# EAGLE design door_module_a (EAGLE 9.6.2)
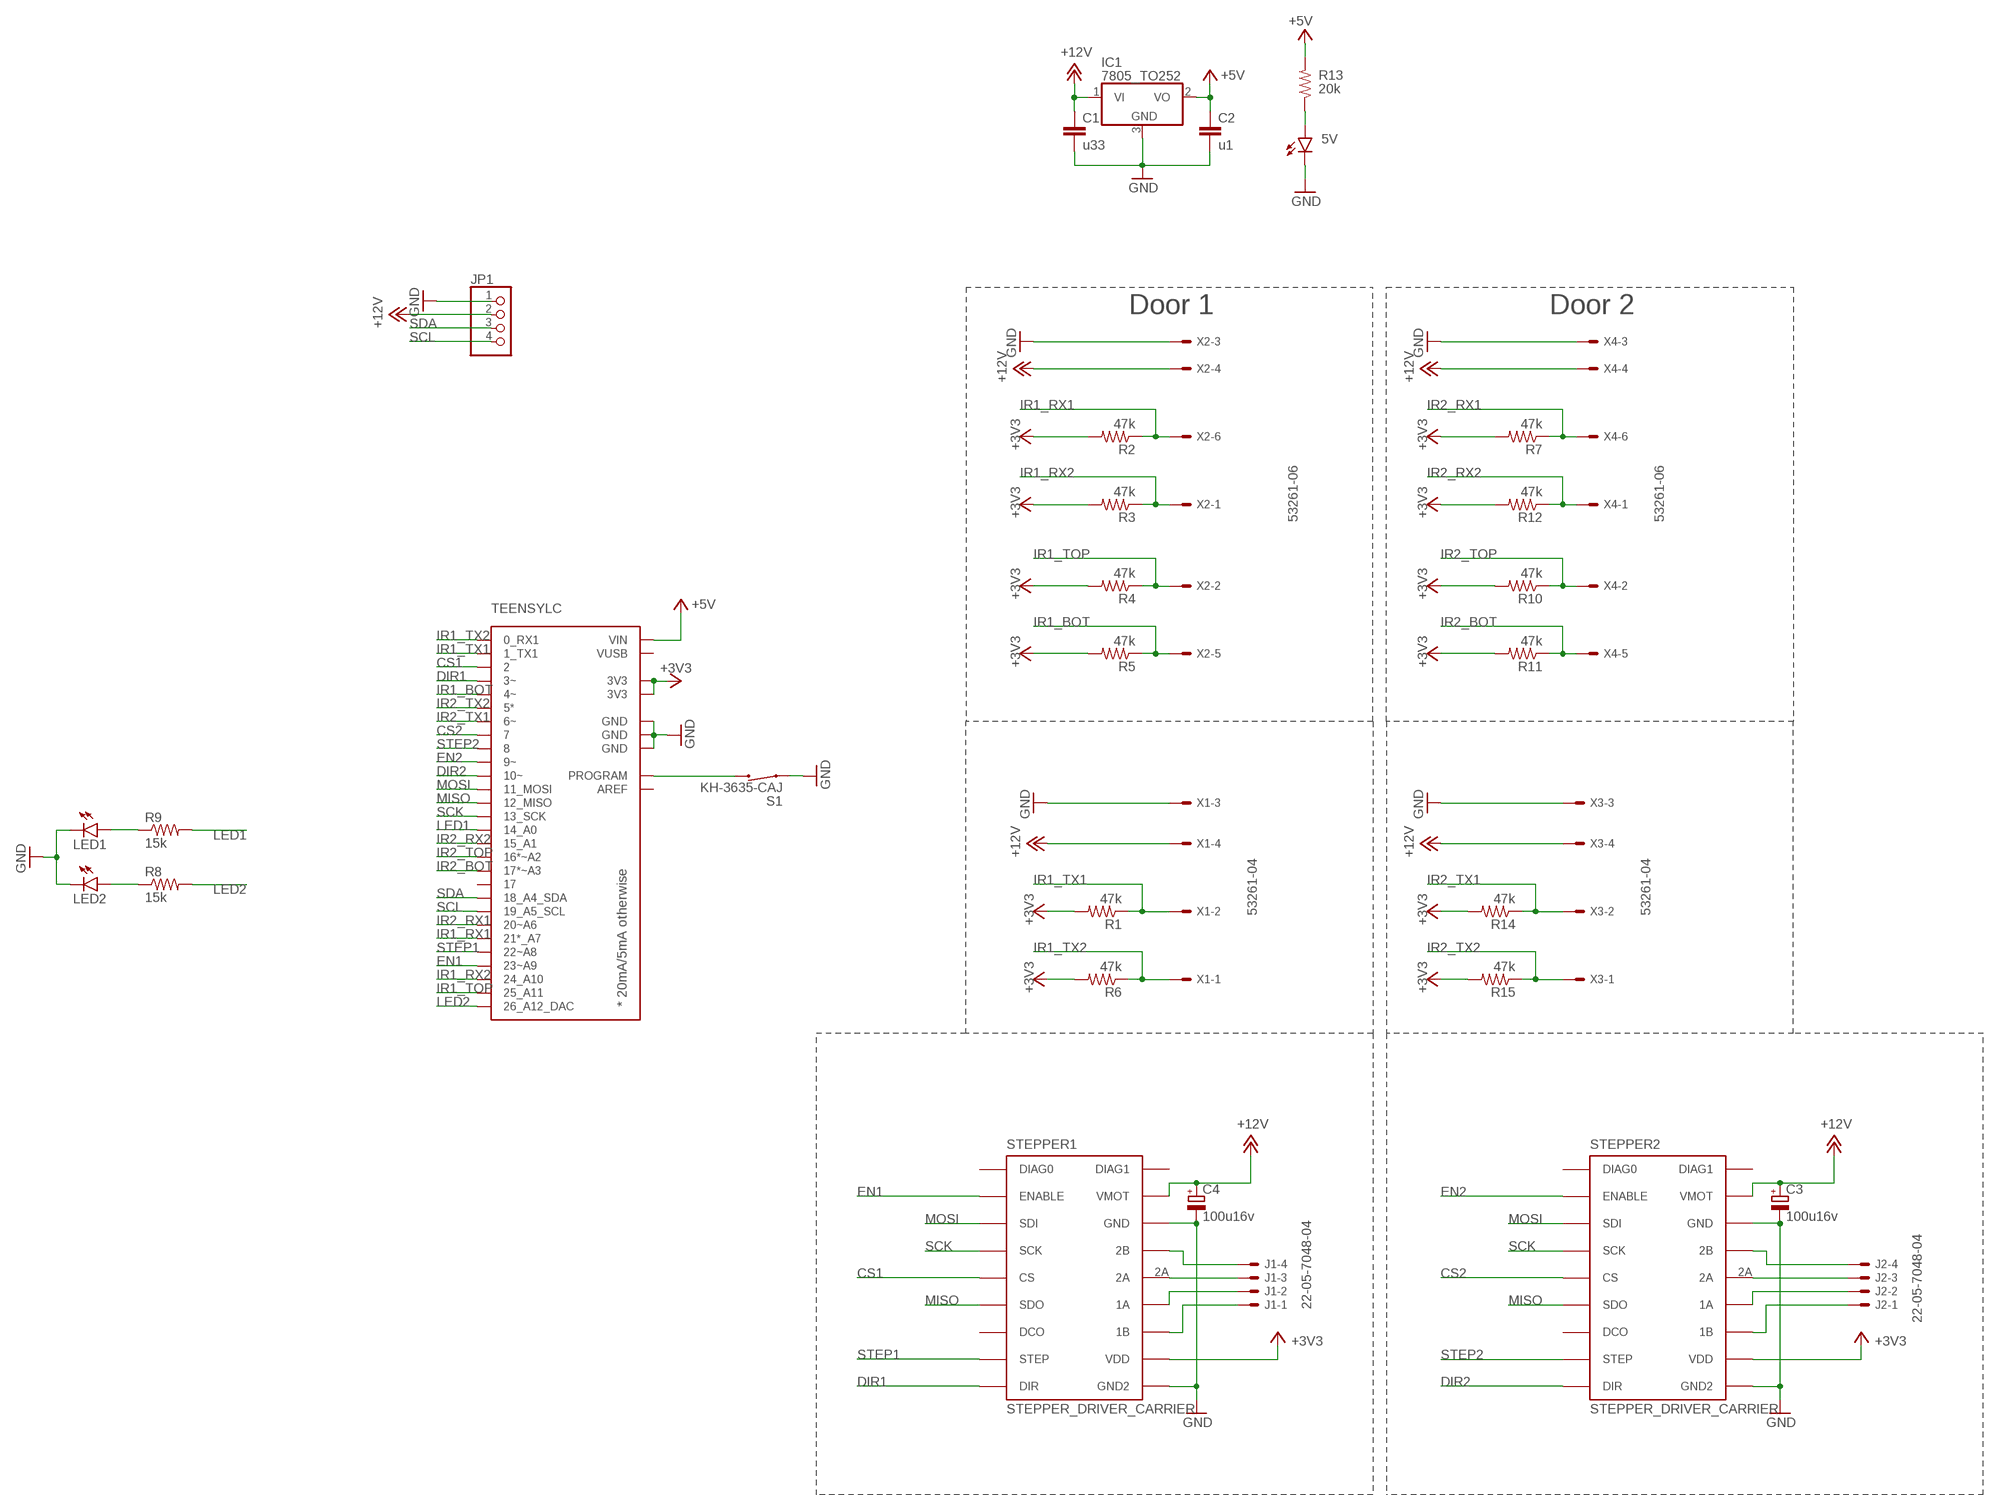
[diagram p0: schematic, sheet 1]

## Parts
5V  LEDCHIPLED_0805  [CHIPLED_0805]
C1  u33  C-EUC0805  [C0805]
C2  u1  C-EUC0805  [C0805]
C3  100u16v  CPOL-EUSMCC  [SMC_C]
C4  100u16v  CPOL-EUSMCC  [SMC_C]
IC1  7805_TO252  [TO252]
J1  22-05-7048-04  [7395-04]
J2  22-05-7048-04  [7395-04]
JP1  PINHD-1X4  [1X04]
LED1  LEDCHIPLED_0805  [CHIPLED_0805]
LED2  LEDCHIPLED_0805  [CHIPLED_0805]
R1  47k  R-US_R0805  [R0805]
R2  47k  R-US_R0805  [R0805]
R3  47k  R-US_R0805  [R0805]
R4  47k  R-US_R0805  [R0805]
R5  47k  R-US_R0805  [R0805]
R6  47k  R-US_R0805  [R0805]
R7  47k  R-US_R0805  [R0805]
R8  15k  R-US_R0805  [R0805]
R9  15k  R-US_R0805  [R0805]
R10  47k  R-US_R0805  [R0805]
R11  47k  R-US_R0805  [R0805]
R12  47k  R-US_R0805  [R0805]
R13  20k  R-US_R0805  [R0805]
R14  47k  R-US_R0805  [R0805]
R15  47k  R-US_R0805  [R0805]
S1  KH-3635-CAJ  [KH-3635-CAJ]
STEPPER1  STEPPER_DRIVER_CARRIER  [TMC2130_CARRIER]
STEPPER2  STEPPER_DRIVER_CARRIER  [TMC2130_CARRIER]
TEENSYLC  TEENSYLC  [TEENSYLC]
X1  53261-04  [53261-04]
X2  53261-06  [53261-06]
X3  53261-04  [53261-04]
X4  53261-06  [53261-06]

## Nets
+3V3: R1.2 R2.2 R3.2 R4.2 R5.2 R6.2 R7.2 R10.2 R11.2 R12.2 R14.2 R15.2 STEPPER1.VIO(VDD) STEPPER2.VIO(VDD) TEENSYLC.3V3 TEENSYLC.3V3@2(3V3)
+5V: C2.1 IC1.2(VO) R13.2 TEENSYLC.VIN
+12V: C1.1 C3.+ C4.+ IC1.1(VI) JP1.2 STEPPER1.VMOT STEPPER2.VMOT X1.4 X2.4 X3.4 X4.4
CS1: STEPPER1.CS/CFG3(CS) TEENSYLC.2
CS2: STEPPER2.CS/CFG3(CS) TEENSYLC.7
DIR1: STEPPER1.DIR TEENSYLC.3(3~)
DIR2: STEPPER2.DIR TEENSYLC.10(10~)
EN1: STEPPER1.ENABLE TEENSYLC.23(23~A9)
EN2: STEPPER2.ENABLE TEENSYLC.9(9~)
GND: 5V.C C1.2 C2.2 C3.- C4.- IC1.3(GND) JP1.1 LED1.C LED2.C S1.P$1 STEPPER1.GND STEPPER1.GND2 STEPPER2.GND STEPPER2.GND2 TEENSYLC.GND TEENSYLC.GND@1(GND) TEENSYLC.GND@2(GND) X1.3 X2.3 X3.3 X4.3
IR1_BOT: R5.1 TEENSYLC.4(4~) X2.5
IR1_RX1: R2.1 TEENSYLC.21(21*_A7) X2.6
IR1_RX2: R3.1 TEENSYLC.24(24_A10) X2.1
IR1_TOP: R4.1 TEENSYLC.25(25_A11) X2.2
IR1_TX1: R1.1 TEENSYLC.1(1_TX1) X1.2
IR1_TX2: R6.1 TEENSYLC.0(0_RX1) X1.1
IR2_BOT: R11.1 TEENSYLC.17(17*~A3) X4.5
IR2_RX1: R7.1 TEENSYLC.20(20~A6) X4.6
IR2_RX2: R12.1 TEENSYLC.15(15_A1) X4.1
IR2_TOP: R10.1 TEENSYLC.16(16*~A2) X4.2
IR2_TX1: R14.1 TEENSYLC.6(6~) X3.2
IR2_TX2: R15.1 TEENSYLC.5(5*) X3.1
LED1: R9.2 TEENSYLC.14(14_A0)
LED2: R8.2 TEENSYLC.26(26_A12_DAC)
MISO: STEPPER1.SDO/CFG0(SDO) STEPPER2.SDO/CFG0(SDO) TEENSYLC.12(12_MISO)
MOSI: STEPPER1.SDI/CFG1(SDI) STEPPER2.SDI/CFG1(SDI) TEENSYLC.11(11_MOSI)
N$1: LED2.A R8.1
N$2: LED1.A R9.1
N$3: S1.P$2 TEENSYLC.PROG(PROGRAM)
N$5: J1.4 STEPPER1.2B
N$6: J1.3 STEPPER1.2A
N$8: J1.2 STEPPER1.1A
N$10: J2.2 STEPPER2.1A
N$13: J1.1 STEPPER1.1B
N$14: J2.4 STEPPER2.2B
N$15: J2.3 STEPPER2.2A
N$25: 5V.A R13.1
N$28: J2.1 STEPPER2.1B
SCK: STEPPER1.SCK/CFG2(SCK) STEPPER2.SCK/CFG2(SCK) TEENSYLC.13(13_SCK)
SCL: JP1.4 TEENSYLC.19(19_A5_SCL)
SDA: JP1.3 TEENSYLC.18(18_A4_SDA)
STEP1: STEPPER1.STEP TEENSYLC.22(22~A8)
STEP2: STEPPER2.STEP TEENSYLC.8
Unconnected: STEPPER1.DCO STEPPER1.DIAG0 STEPPER1.DIAG1 STEPPER2.DCO STEPPER2.DIAG0 STEPPER2.DIAG1 TEENSYLC.17@VIN TEENSYLC.AREF TEENSYLC.VUSB

## Notes on the sheet
- Door 1 | Door 2

## Library data of the parts
5V LED1 LED2 = led:LED: LED OSRAM: - CHIPLED LG R971, LG N971, LY N971, LG Q971, LY Q971, LO R971, LY R971 LH N974, LH R974 LS Q976, LO Q976, LY Q976 LO Q996 - Hyper CHIPLED LW Q18S LB Q993, LB Q99A, LB R99A - SideLED LS A670, LO A670, LY A670, LG A670, LP A670 LB A673, LV A673, LT A673, LW A673 LH A674 LY A675 LS A676, LA A676, LO A676, LY A676, LW A676 LS A679, LY A679, LG A679 - Hyper Micro SIDELED® LS Y876, LA Y876, LO Y876, LY Y876 LT Y87S - SmartLED LW L88C, LW L88S LB L89C, LB L89S, LG L890 LS L89K, LO L89K, LY L89K LS L896, LA L896, LO L896, LY L896 - TOPLED LS T670, LO T670, LY T670, LG T670, LP T670 LSG T670, LSP T670, LSY T670, LOP T670, LYG T670 LG T671, LOG T671, LSG T671 LB T673, LV T673, LT T673, LW T673 LH T674 LS T676, LA T676, LO T676, LY T676, LB T676, LH T676, LSB T676, LW T676 LB T67C, LV T67C, LT T67C, LS T67K, LO T67K, LY T67K, LW E67C LS E67B, LA E67B, LO E67B, LY E67B, LB E67C, LV E67C, LT E67C LW T67C LS T679, LY T679, LG T679 LS T770, LO T770, LY T770, LG T770, LP T770 LB T773, LV T773, LT T773, LW T773 LH T774 LS E675, LA E675, LY E675, LS T675 LS T776, LA T776, LO T776, LY T776, LB T776 LHGB T686 LT T68C, LB T68C - Hyper Mini TOPLED® LB M676 - Mini TOPLED Santana® LG M470 LS M47K, LO M47K, LY M47K Source: http://www.osram.convergy.de LUXEON: - LUMILED® LXK2-PW12-R00, LXK2-PW12-S00, LXK2-PW14-U00, LXK2-PW14-V00 LXK2-PM12-R00, LXK2-PM12-S00, LXK2-PM14-U00 LXK2-PE12-Q00, LXK2-PE12-R00, LXK2-PE12-S00, LXK2-PE14-T00, LXK2-PE14-U00 LXK2-PB12-K00, LXK2-PB12-L00, LXK2-PB12-M00, LXK2-PB14-N00, LXK2-PB14-P00, LXK2-PB14-Q00 LXK2-PR12-L00, LXK2-PR12-M00, LXK2-PR14-Q00, LXK2-PR14-R00 LXK2-PD12-Q00, LXK2-PD12-R00, LXK2-PD12-S00 LXK2-PH12-R00, LXK2-PH12-S00 LXK2-PL12-P00, LXK2-PL12-Q00, LXK2-PL12-R00 Source: www.luxeon.com KINGBRIGHT: KA-3528ASYC Source: www.kingbright.com
C1 C2 = rcl:C-EU: CAPACITOR, European symbol; SPICEPREFIX: C
C3 C4 = rcl:CPOL-EU: POLARIZED CAPACITOR, European symbol; SPICEPREFIX: C
IC1 = 000-my_library:7805_TO252
J1 J2 = con-molex:22-?-04: CONNECTOR wire to board 2.54 mm (.1 inch) pitch header; MF: MOLEX; OC_FARNELL: unknown; OC_NEWARK: unknown
JP1 = pinhead:PINHD-1X4: PIN HEADER
R1-R15 = rcl:R-US_: RESISTOR, American symbol; SPICEPREFIX: R
S1 = 000-my_library:KH-3635-CAJ
STEPPER1 STEPPER2 = 000-my_library:STEPPER_DRIVER_CARRIER
TEENSYLC = 000-my_library:TEENSYLC
X1 X3 = con-molex:53?-04: CONNECTOR wire to board 1.25 mm (.049 inch) pitch header; MF: MOLEX; OC_FARNELL: 1125374; OC_NEWARK: unknown
X2 X4 = con-molex:53?-06: CONNECTOR wire to board 1.25 mm (.049 inch) pitch header; MF: MOLEX; OC_FARNELL: 1125375; OC_NEWARK: unknown

## Board
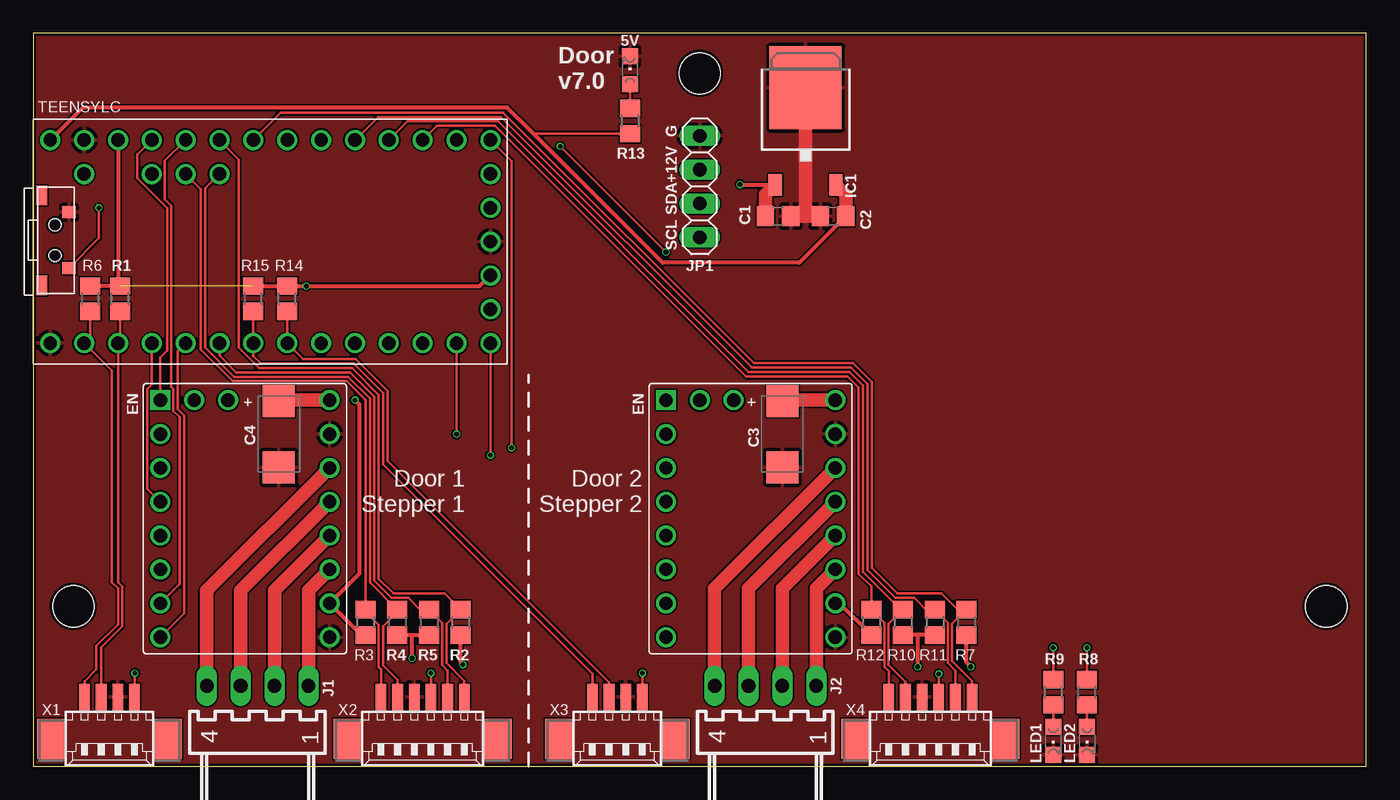
[diagram p1: board, top side]
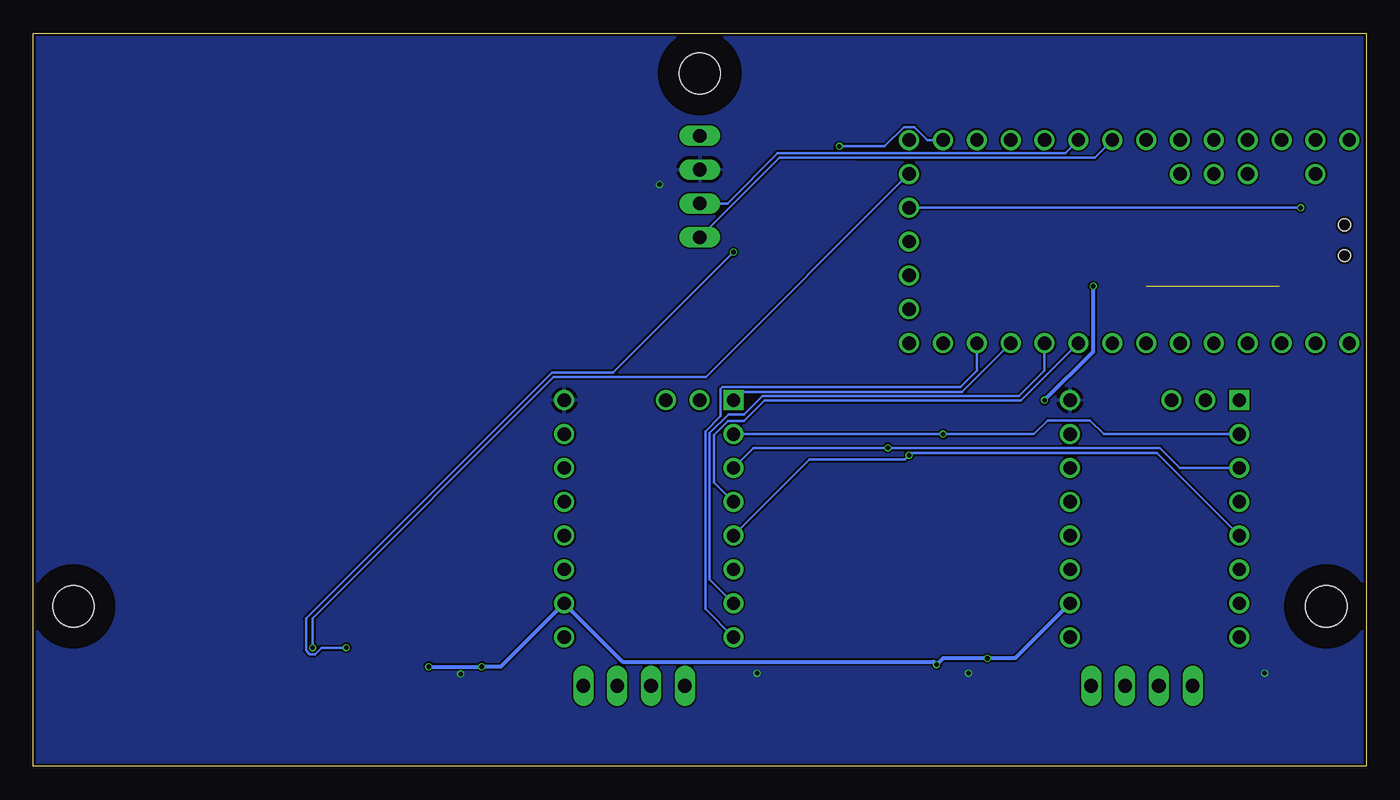
[diagram p2: board, bottom side, seen from below]

Size 100 x 55 mm. Coordinates in mm from the lower left corner, seen from the top.
Outline: 100,0 100,55 0,55 0,0 100,0
Copper layers (1*16): Top 0.035559375mm / dielectric 1.6mm / Bottom 0.035559375mm
Design rules "jlcpcb2layer *": minimum track width 8mil, minimum drill 12mil, track to track 5mil, track to pad 5mil, pad to pad 5mil, via to via 5mil, smd to smd 5mil, copper to edge 8mil, drill to drill 6mil, minimum pad ring 5mil, minimum via ring 3mil, stop-mask expansion 2.5mil, vias tented up to drill 0mil, thermal gap 10mil
Holes 3.1 mm at 97,12 50,52 3,12
bRestrict: area 46.9,48.9 to 53.1,55.1; area 93.9,8.9 to 100.1,15.1; area -0.1,8.9 to 6.1,15.1

### Footprints (pad centres in the part's own frame; a part is rotated, then mirrored left to right if it is on the bottom)
CHIPLED_0805 = smd 1.2 x 1.2: A 0,-1.05; C 0,1.05
C0805 = smd 1.3 x 1.5: 1 -0.95,0; 2 0.95,0
SMC_C = smd 2.4 x 2.4: + -2.5,0; - 2.5,0
TO252 = smd 1 x 1.6: 1 -2.28,-4.8; 2 2.28,-4.8 | smd 5.4 x 6.2: 3 0,2.5
7395-04 = drill 1.016 long: 1 3.81,0; 2 1.27,0; 3 -1.27,0; 4 -3.81,0
1X04 = drill 1.016 long: 1 -3.81,0; 2 -1.27,0; 3 1.27,0; 4 3.81,0
R0805 = smd 1.3 x 1.5: 1 -0.95,0; 2 0.95,0
KH-3635-CAJ = smd 0.9 x 1: P$1 -2.1,1.05; P$2 2.1,1.05 | smd 1.45 x 0.8: P$3 -3.375,-1; P$4 3.375,-1 | hole 0.9: -1.15,0; 1.15,0
TMC2130_CARRIER = drill 1: 1A 13.97,8.89; 1B 13.97,6.35; 2A 13.97,11.43; 2B 13.97,13.97; CS/CFG3 1.27,11.43; DCO 1.27,6.35; DIAG0 3.81,19.05; DIAG1 6.35,19.05; DIR 1.27,1.27; GND 13.97,16.51; GND2 13.97,1.27; SCK/CFG2 1.27,13.97; SDI/CFG1 1.27,16.51; SDO/CFG0 1.27,8.89; STEP 1.27,3.81; VIO 13.97,3.81; VMOT 13.97,19.05 | drill 1 square: ENABLE 1.27,19.05
TEENSYLC = drill 1: 0 -13.97,-7.62; 1 -11.43,-7.62; 2 -8.89,-7.62; 3 -6.35,-7.62; 3V3 -11.43,7.62; 3V3@2 16.51,-2.54; 4 -3.81,-7.62; 5 -1.27,-7.62; 6 1.27,-7.62; 7 3.81,-7.62; 8 6.35,-7.62; 9 8.89,-7.62; 10 11.43,-7.62; 11 13.97,-7.62; 12 16.51,-7.62; 13 16.51,7.62; 14 13.97,7.62; 15 11.43,7.62; 16 8.89,7.62; 17 6.35,7.62; 17@VIN 16.51,-5.08; 18 3.81,7.62; 19 1.27,7.62; 20 -1.27,7.62; 21 -3.81,7.62; 22 -6.35,7.62; 23 -8.89,7.62; 24 -6.35,5.08; 25 -3.81,5.08; 26 16.51,5.08; AREF -8.89,5.08; GND -16.51,-7.62; GND@1 -13.97,7.62; GND@2 16.51,0; PROG 16.51,2.54; VIN -16.51,7.62; VUSB -13.97,5.08
53261-04 = smd 0.8 x 2: 1 1.875,-2.5; 2 0.625,-2.5; 3 -0.625,-2.5; 4 -1.875,-2.5 | smd 2.1 x 3: S1 4.375,0.625; S2 -4.375,0.625
53261-06 = smd 0.8 x 2: 1 3.125,-2.5; 2 1.875,-2.5; 3 0.625,-2.5; 4 -0.625,-2.5; 5 -1.875,-2.5; 6 -3.125,-2.5 | smd 2.1 x 3: S1 5.625,0.625; S2 -5.625,0.625

### Placement (x,y rotation side)
5V  44.77,52.23 0 top
C1  55.88,41.27 0 top
C2  60.01,41.27 180 top
C3  56.2,24.92 270 top
C4  18.41,24.92 270 top
IC1  57.94,48.42 0 top
J1  16.83,6.03 0 top
J2  54.93,6.03 0 top
JP1  50,43.5 270 top
LED1  76.52,1.91 180 top
LED2  79.06,1.91 180 top
R1  6.51,35.08 90 top
R2  32.07,10.79 270 top
R3  24.92,10.79 270 top
R4  27.3,10.79 270 top
R5  29.69,10.79 270 top
R6  4.29,35.08 90 top
R7  70.01,10.79 270 top
R8  79.06,5.56 90 top
R9  76.52,5.56 90 top
R10  65.25,10.79 270 top
R11  67.63,10.79 270 top
R12  62.87,10.79 270 top
R13  44.77,48.42 270 top
R14  19.05,35.08 90 top
R15  16.51,35.08 90 top
S1  1.63,39.47 270 top
STEPPER1  8.26,8.41 0 top
STEPPER2  46.2,8.41 0 top
TEENSYLC  17.78,39.37 0 top
X1  5.71,2.7 180 top
X2  29.21,2.7 180 top
X3  43.81,2.7 180 top
X4  67.31,2.7 180 top

### Tracks (layer width: path | path; a pad name or v marks a point on that pad's centre or on a via)
+3V3  (via drill 0.35)  (1 unrouted)
  Top 0.305: R4.2 28.42,9.85 | 28.42,9.85 R5.2 | R3.2 24.61,9.85 STEPPER1.VIO 24.45,14.45 24.45,27.15 v24.13,27.46 | v28.42,8.1 28.42,9.85 | R6.2 R1.2 6.35,36.19 TEENSYLC.3V3 | R11.2 66.36,9.85 | 66.36,9.85 R10.2 | R12.2 60.49,12.22 STEPPER2.VIO | v66.36,7.46 66.36,9.85 | v32.23,7.62 32.07,7.78 R2.2 | v70.33,7.46 70.01,7.78 R7.2 | R15.2 R14.2 v20.48,36.03 33.49,36.03 TEENSYLC.3V3@2
  Bottom 0.305: STEPPER1.VIO 26.35,8.1 v28.42,8.1 31.75,8.1 v32.23,7.62 32.44,7.84 55.78,7.84 STEPPER2.VIO 64.93,7.46 v66.36,7.46 v70.33,7.46 | v24.13,27.46 20.48,31.11 v20.48,36.03
+5V
  Top 0.203: R13.2 37.52,47.47 37.26,47.74
  Top 0.305: C2.1 57.47,37.78 47.21,37.78 37.26,47.74 35.56,49.44 3.71,49.44 TEENSYLC.VIN
  Top 1.016: C2.1 60.96,42.88 IC1.2
+12V  (via drill 0.35)
  Top 0.203: X2.4 v29.84,6.99 | X1.4 7.62,5.23 v7.62,6.99 | X3.4 v45.69,6.99 | X4.4 v67.94,6.92
  Top 0.305: IC1.1 53.06,43.62 v53.02,43.66
  Top 1.016: STEPPER1.VMOT 18.45,27.46 C4.+ | STEPPER2.VMOT 56.24,27.46 C3.+ | C1.1 54.93,42.88 IC1.1
  pour Bottom: -0.64,55.88 100.97,55.88 100.97,-0.64 -0.64,-0.64
CS1
  Top 0.203: TEENSYLC.2 8.89,28.65 8.55,28.31 8.55,20.82 STEPPER1.CS/CFG3
CS2
  Bottom 0.203: STEPPER2.CS/CFG3 48.92,21.3 48.92,24.85 47.87,25.9 46.69,25.9 45.16,27.44 25.9,27.44 TEENSYLC.7
DIR1
  Top 0.203: TEENSYLC.3 10.83,31.15 10.83,26.81 11.31,26.33 11.31,11.47 STEPPER1.DIR
DIR2
  Bottom 0.203: STEPPER2.DIR 49.58,11.8 49.58,25.13 48.45,26.26 48.45,28.31 48.31,28.44 30.45,28.44 29.21,29.69 TEENSYLC.10
EN1
  Top 0.203: STEPPER1.ENABLE 9.53,30.68 10.03,31.19 10.03,41.88 7.78,44.13 7.78,45.88 TEENSYLC.23
EN2
  Bottom 0.203: TEENSYLC.9 30.32,28.1 46.83,28.1 STEPPER2.ENABLE
GND
  Top 1.016: C1.2 57.94,41.27 | 57.94,41.27 C2.2 | 57.94,41.27 IC1.3
  pour Top: -1.27,56.67 101.76,56.67 101.76,-1.27 -1.27,-1.27
IR1_BOT
  Top 0.203: TEENSYLC.4 13.97,30.8 15.22,29.55 23.77,29.55 25.58,27.74 25.58,13.93 26.89,12.62 28.15,12.62 29.03,11.74 R5.1 30.66,10.77 30.66,7.59 31.09,7.17 X2.5
IR1_RX1
  Top 0.203: X2.6 32.34,6.4 31,7.74 31,10.67 R2.1 30.86,12.95 27.03,12.95 25.91,14.07 25.91,27.87 23.91,29.88 16.95,29.88 15.43,31.41 15.43,45.53 TEENSYLC.21
IR1_RX2
  Top 0.203: X2.1 26.09,7.25 25.9,7.43 25.9,10.59 24.92,11.57 R3.1 24.92,27.46 23.5,28.89 14.95,28.89 12.57,31.27 12.57,43.31 TEENSYLC.24
IR1_TOP
  Top 0.203: X2.2 27.34,6.48 26.23,7.58 26.23,10.5 27.3,11.57 R4.1 25.25,13.8 25.25,27.6 23.63,29.22 15.09,29.22 12.9,31.41 12.9,43.38 TEENSYLC.25
IR1_TX1
  Top 0.203: X1.2 5.09,8.91 6.68,10.5 6.68,13.48 6.35,13.81 TEENSYLC.1 6.51,31.91 R1.1
IR1_TX2
  Top 0.203: R6.1 4.29,32.23 TEENSYLC.0 5.87,29.69 5.87,13.81 6.35,13.34 6.35,10.64 4.73,9.02 4.73,7.26 3.84,6.37 X1.1
IR2_BOT
  Top 0.203: X4.5 69.19,7.17 68.61,7.75 68.61,10.77 67.71,11.67 | 67.71,11.67 R11.1 | TEENSYLC.17 25.86,48.72 35.1,48.72 53.91,29.91 61.35,29.91 62.57,28.69 62.57,14.73 64.68,12.62 66.09,12.62 67.05,11.67 67.71,11.67
IR2_RX1
  Top 0.203: X4.6 70.44,6.4 68.94,7.9 68.94,10.67 R7.1 69.35,11.74 68.14,12.95 64.81,12.95 62.9,14.86 62.9,28.83 61.49,30.24 54.05,30.24 35.24,49.05 18.57,49.05 TEENSYLC.20
IR2_RX2
  Top 0.203: X4.1 64.19,7.1 63.84,7.45 63.84,10.77 R12.1 62.87,13.49 61.91,14.44 61.91,28.42 61.08,29.25 53.46,29.25 34.65,48.06 30.28,48.06 TEENSYLC.15
IR2_TOP
  Top 0.203: X4.2 65.44,6.34 64.17,7.61 64.17,10.67 R10.1 65.09,11.74 62.24,14.59 62.24,28.55 61.21,29.58 53.66,29.58 34.85,48.39 28.07,48.39 TEENSYLC.16
IR2_TX1
  Top 0.203: R14.1 TEENSYLC.6 20.26,30.54 24.18,30.54 26.57,28.15 26.57,22.92 43.19,6.31 X3.2
IR2_TX2
  Top 0.203: R15.1 TEENSYLC.5 16.51,30.8 17.09,30.21 24.04,30.21 26.25,28.01 26.25,22.64 41.94,6.95 X3.1
LED1  (via drill 0.35)
  Top 0.203: v39.53,46.51 v47.47,38.58 | v76.52,8.89 R9.2
  Bottom 0.203: v39.53,46.51 36.15,46.51 34.7,47.97 33.88,47.97 32.91,46.99 TEENSYLC.14 | v47.47,38.58 56.5,29.54 61.1,29.54 79.55,11.09 79.55,8.69 79.26,8.4 78.85,8.4 78.36,8.89 v76.52,8.89
LED2  (via drill 0.35)
  Top 0.203: v79.06,8.89 R8.2
  Bottom 0.203: TEENSYLC.26 49.53,29.21 60.96,29.21 79.06,11.11 v79.06,8.89
MISO  (via drill 0.35)
  Top 0.203: TEENSYLC.12 v34.29,23.34
  Bottom 0.203: STEPPER2.SDO/CFG0 41.75,23.02 34.61,23.02 v34.29,23.34 34.13,23.5 15.72,23.5 STEPPER1.SDO/CFG0
MOSI  (via drill 0.35)
  Top 0.203: TEENSYLC.11 v31.75,24.92
  Bottom 0.203: STEPPER2.SDI/CFG1 v31.75,24.92 24.92,24.92 23.89,25.96 20.72,25.96 19.68,24.92 STEPPER1.SDI/CFG1
N$1
  Top 0.203: LED2.A R8.1
N$2
  Top 0.203: LED1.A R9.1
N$3  (via drill 0.35)
  Top 0.203: v4.92,41.91 4.92,39.62 S1.P$2
  Bottom 0.203: v4.92,41.91 TEENSYLC.PROG
N$5
  Top 1.016: J1.4 13.02,13.18 STEPPER1.2B
N$6
  Top 1.016: STEPPER1.2A 15.56,13.18 J1.3
N$8
  Top 1.016: STEPPER1.1A 18.1,13.18 J1.2
N$10
  Top 1.016: STEPPER2.1A 56.2,13.34 J2.2
N$13
  Top 1.016: STEPPER1.1B 20.64,13.18 J1.1
N$14
  Top 1.016: J2.4 51.12,13.34 STEPPER2.2B
N$15
  Top 1.016: STEPPER2.2A 53.66,13.34 J2.3
N$25
  Top 0.203: 5V.A R13.1
N$28
  Top 1.016: J2.1 58.74,13.34 STEPPER2.1B
SCK  (via drill 0.35)
  Top 0.203: TEENSYLC.13 35.88,45.4 v35.88,23.89
  Bottom 0.203: STEPPER2.SCK/CFG2 45.96,23.89 v35.88,23.89 15.48,23.89 13.97,22.38 STEPPER1.SCK/CFG2
SCL
  Bottom 0.203: TEENSYLC.19 20.36,45.68 38.26,45.68 38.29,45.68 44.01,45.68 JP1.4
SDA
  Bottom 0.203: TEENSYLC.18 22.57,46.01 44.16,46.01 47.94,42.23 JP1.3
STEP1
  Top 0.203: STEPPER1.STEP 10.98,13.68 10.98,26.19 10.5,26.67 10.5,28.31 10.36,28.45 10.36,42.07 9.87,42.56 9.87,45.43 TEENSYLC.22
STEP2
  Bottom 0.203: STEPPER2.STEP 49.25,14.01 49.25,24.99 47.85,26.39 46.67,26.39 45.3,27.77 26.05,27.77 24.13,29.69 TEENSYLC.8

### Text on the board
tNames: Door / v7.0 | SCL SDA+12V G | EN | EN | + | + | Door 1 / Stepper 1 | Door 2 / Stepper 2